# EAGLE design cms_intro_adc (EAGLE 5.10)
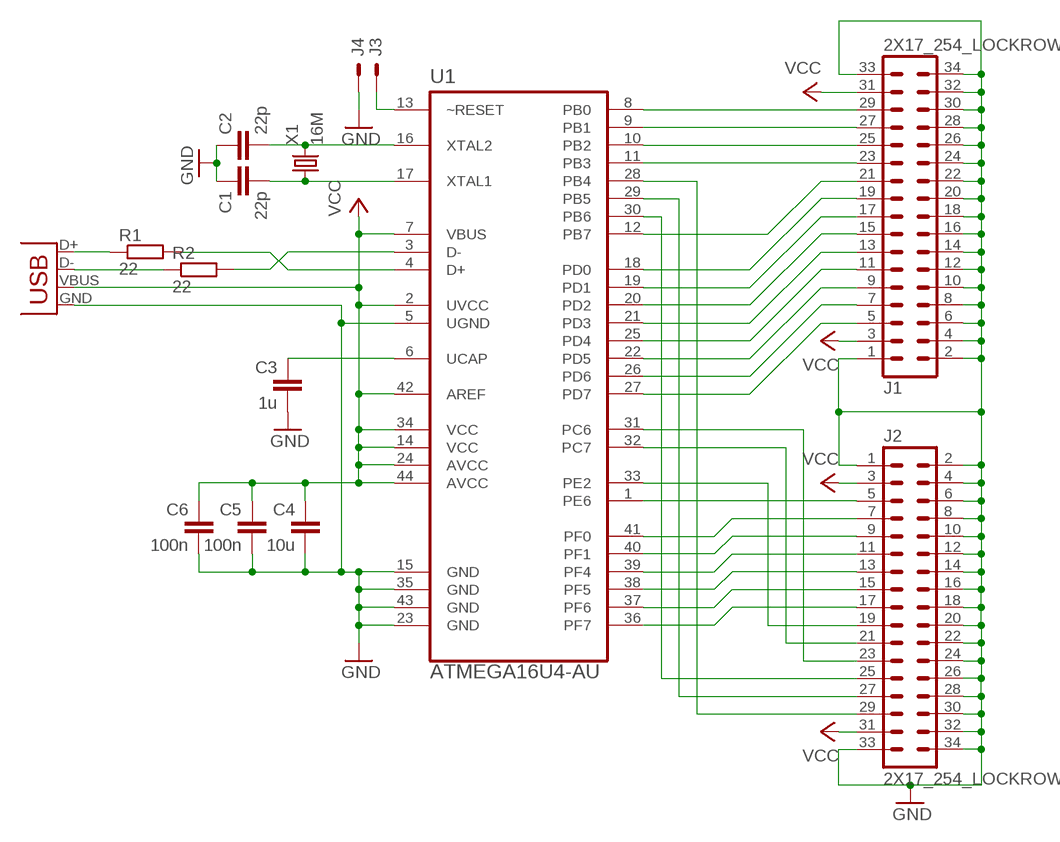
[diagram p0: schematic, sheet 1]

## Parts
C1  22p  C-EUC0603  [C0603]
C2  22p  C-EUC0603  [C0603]
C3  1u  C-EUC0603  [C0603]
C4  10u  C-EUC0603  [C0603]
C5  100n  C-EUC0603  [C0603]
C6  100n  C-EUC0603  [C0603]
J1  2X17_254_LOCKROW  [2X17_254_LOCKROW]
J2  2X17_254_LOCKROW  [2X17_254_LOCKROW]
J3  1X1E_254  [1X1_254]
J4  1X1E_254  [1X1_254]
R1  22  R-EU_R0603  [R0603]
R2  22  R-EU_R0603  [R0603]
U1  ATMEGA16U4-AU  [QFP80P1200X1200X120-44N]
X1  16M  CRYSTALSM49  [SM49]
X7  USB-MICROB-S-LONG  [USB-MICROB-LONG]

## Nets
B0: J1.29 U1.8(PB0)
B1: J1.27 U1.9(PB1)
B2: J1.25 U1.10(PB2)
B3: J1.23 U1.11(PB3)
B4: J2.29 U1.28(PB4)
B5: J2.27 U1.29(PB5)
B6: J2.25 U1.30(PB6)
B7: J1.21 U1.12(PB7)
C6: J2.23 U1.31(PC6)
C7: J2.21 U1.32(PC7)
D0: J1.19 U1.18(PD0)
D1: J1.17 U1.19(PD1)
D2: J1.15 U1.20(PD2)
D3: J1.13 U1.21(PD3)
D4: J1.11 U1.25(PD4)
D5: J1.9 U1.22(PD5)
D6: J1.7 U1.26(PD6)
D7: J1.5 U1.27(PD7)
DM: R2.2 U1.3(D-)
DMC: R2.1 X7.D-
DP: R1.2 U1.4(D+)
DPC: R1.1 X7.D+
E2_HWB: J2.19 U1.33(PE2)
E6: J2.5 U1.1(PE6)
F0: J2.7 U1.41(PF0)
F1: J2.9 U1.40(PF1)
F4: J2.11 U1.39(PF4)
F5: J2.13 U1.38(PF5)
F6: J2.15 U1.37(PF6)
F7: J2.17 U1.36(PF7)
GND [supply]: C1.1 C2.1 C3.2 C4.2 C5.2 C6.2 J1.1 J1.2 J1.4 J1.6 J1.8 J1.10 J1.12 J1.14 J1.16 J1.18 J1.20 J1.22 J1.24 J1.26 J1.28 J1.30 J1.32 J1.33 J1.34 J2.1 J2.2 J2.4 J2.6 J2.8 J2.10 J2.12 J2.14 J2.16 J2.18 J2.20 J2.22 J2.24 J2.26 J2.28 J2.30 J2.32 J2.33 J2.34 J4.1(S) U1.5(UGND) U1.15(GND) U1.23(GND) U1.35(GND) U1.43(GND) X7.GND
RESET: J3.1(S) U1.13(~RESET)
UCAP: C3.1 U1.6(UCAP)
VCC [supply]: C4.1 C5.1 C6.1 J1.3 J1.31 J2.3 J2.31 U1.2(UVCC) U1.7(VBUS) U1.14(VCC) U1.24(AVCC) U1.34(VCC) U1.42(AREF) U1.44(AVCC) X7.VBUS
XTAL1: C1.2 U1.17(XTAL1) X1.1
XTAL2: C2.2 U1.16(XTAL2) X1.2

## Library data of the parts
C1-C6 = rcl:C-EU: CAPACITOR, European symbol
J1 J2 = ni-con-rect:2X17_: 2x17 connector
J3 J4 = ni-con-rect:1X1E_: 1x1 connector
R1 R2 = rcl:R-EU_: RESISTOR, European symbol
U1 = at90usb16u4:ATMEGA16U4-AU: Microcontroller with USB Controller; MPN: ATMEGA16U4-AU; OC_FARNELL: 1748521; OC_NEWARK: 26R5623; PACKAGE: TQFP-44; SUPPLIER: Atmel
X1 = crystal:CRYSTAL: CRYSTAL
X7 = apbteam_con-usb:USB: USB Connectors

## Net classes
1 supply: width 0.254 mm

## Board
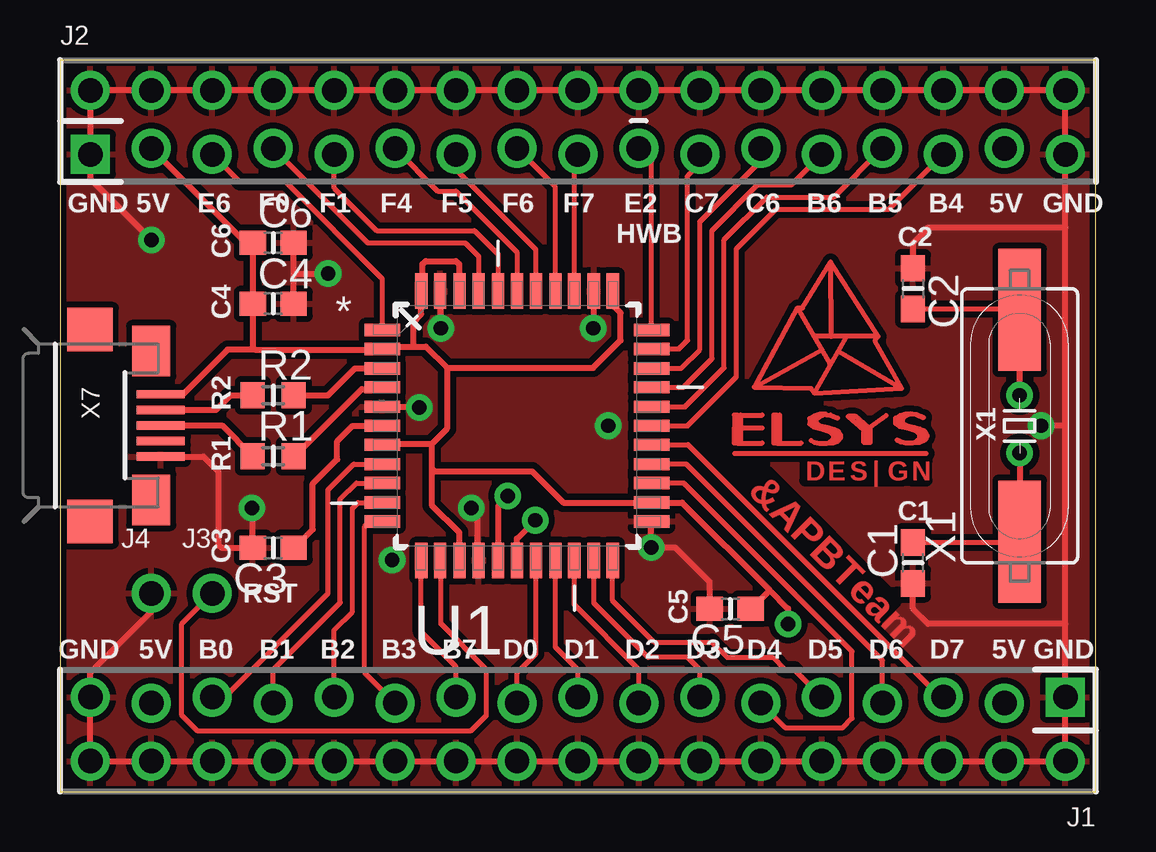
[diagram p1: board, top side]
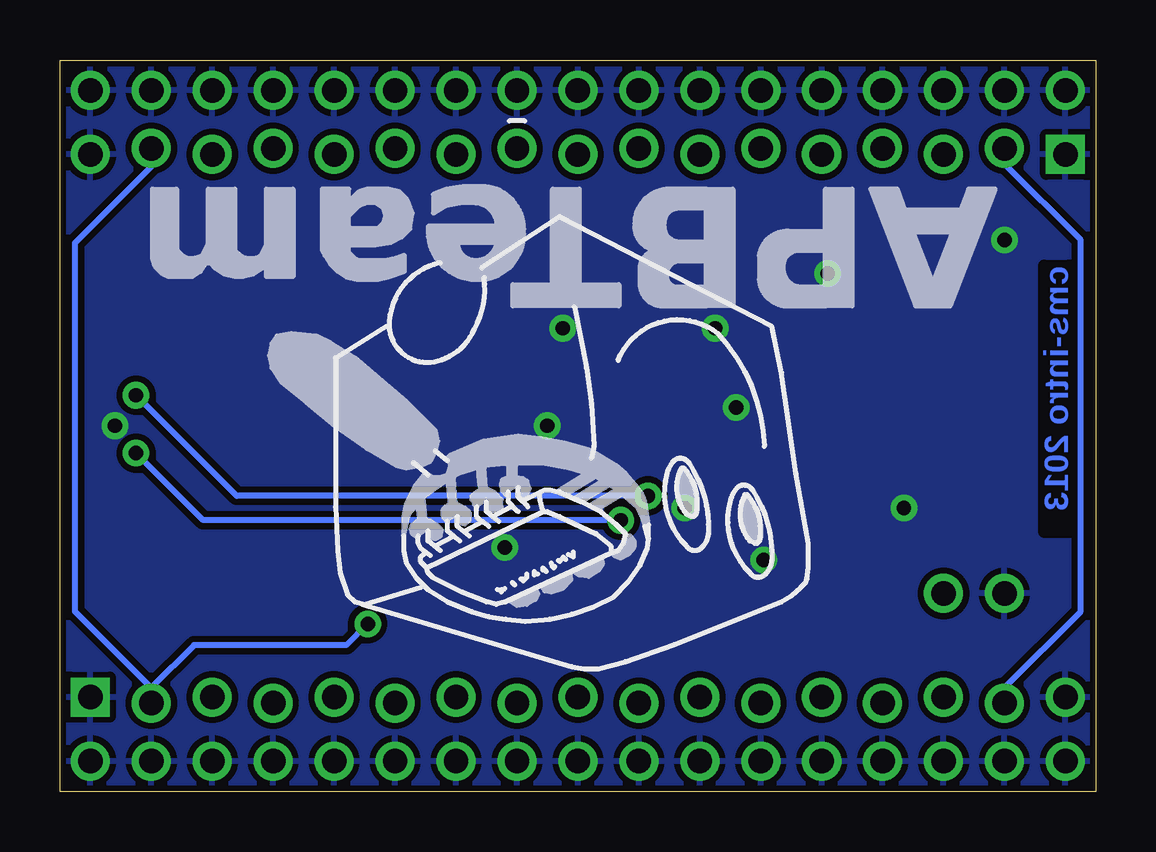
[diagram p2: board, bottom side, seen from below]

Size 43.18 x 30.48 mm. Coordinates in mm from the lower left corner, seen from the top.
Outline: 0,0 43.18,0 43.18,30.48 0,30.48 0,0
Copper layers (1*16): Top 0.035mm / dielectric 1.5mm / Bottom 0.035mm
Design rules "SparkFun *": minimum track width 8mil, minimum drill 20mil, track to track 8mil, track to pad 8mil, pad to pad 8mil, via to via 8mil, smd to smd 8mil, copper to edge 10mil, drill to drill 8mil, minimum pad ring 12mil, minimum via ring 10mil, stop-mask expansion 4mil, vias tented up to drill 25mil, thermal gap 10mil
tRestrict: area -0.1,12.2 to 2.6,18.3

### Footprints (pad centres in the part's own frame; a part is rotated, then mirrored left to right if it is on the bottom)
C0603 = smd 1.1 x 1: 1 -0.85,0; 2 0.85,0
2X17_254_LOCKROW = drill 1.016 square: 1 -20.32,-1.397 | drill 1.016 round: 2 -20.32,1.27; 3 -17.78,-1.143; 4 -17.78,1.27; 5 -15.24,-1.397; 6 -15.24,1.27; 7 -12.7,-1.143; 8 -12.7,1.27; 9 -10.16,-1.397; 10 -10.16,1.27; 11 -7.62,-1.143; 12 -7.62,1.27; 13 -5.08,-1.397; 14 -5.08,1.27; 15 -2.54,-1.143; 16 -2.54,1.27; 17 0,-1.397; 18 0,1.27; 19 2.54,-1.143; 20 2.54,1.27; 21 5.08,-1.397; 22 5.08,1.27; 23 7.62,-1.143; 24 7.62,1.27; 25 10.16,-1.397; 26 10.16,1.27; 27 12.7,-1.143; 28 12.7,1.27; 29 15.24,-1.397; 30 15.24,1.27; 31 17.78,-1.143; 32 17.78,1.27; 33 20.32,-1.397; 34 20.32,1.27
1X1_254 = drill 1.016 round: 1 0,0
R0603 = smd 1 x 1.1: 1 -0.85,0; 2 0.85,0
QFP80P1200X1200X120-44N = smd 1.473 x 0.508: 1 -5.613,3.988; 2 -5.613,3.2; 3 -5.613,2.388; 4 -5.613,1.6; 5 -5.613,0.787; 6 -5.613,0; 7 -5.613,-0.787; 8 -5.613,-1.6; 9 -5.613,-2.388; 10 -5.613,-3.2; 11 -5.613,-3.988; 23 5.613,-3.988; 24 5.613,-3.2; 25 5.613,-2.388; 26 5.613,-1.6; 27 5.613,-0.787; 28 5.613,0; 29 5.613,0.787; 30 5.613,1.6; 31 5.613,2.388; 32 5.613,3.2; 33 5.613,3.988 | smd 0.508 x 1.473: 12 -3.988,-5.613; 13 -3.2,-5.613; 14 -2.388,-5.613; 15 -1.6,-5.613; 16 -0.787,-5.613; 17 0,-5.613; 18 0.787,-5.613; 19 1.6,-5.613; 20 2.388,-5.613; 21 3.2,-5.613; 22 3.988,-5.613; 34 3.988,5.613; 35 3.2,5.613; 36 2.388,5.613; 37 1.6,5.613; 38 0.787,5.613; 39 0,5.613; 40 -0.787,5.613; 41 -1.6,5.613; 42 -2.388,5.613; 43 -3.2,5.613; 44 -3.988,5.613
SM49 = smd 5.08 x 1.778: 1 -4.826,0; 2 4.826,0
USB-MICROB-LONG = smd 0.35 x 2: D+ 0,2.95; D- -0.65,2.95; GND 1.3,2.95; ID 0.65,2.95; VBUS -1.3,2.95 | smd 1.8 x 1.9: MT1 -4,0; MT2 4,0 | smd 2.1 x 1.6: MT3 -3.1,2.55; MT4 3.1,2.55

### Placement (x,y rotation side)
C1  35.56,9.53 90 top
C2  35.56,20.95 270 top
C3  8.89,10.16 180 top
C4  8.89,20.32 0 top
C5  27.94,7.62 180 top
C6  8.89,22.86 0 top
J1  21.59,2.54 180 top
J2  21.59,27.94 0 top
J3  6.35,8.26 0 top
J4  3.81,8.26 0 top
R1  8.89,13.97 0 top
R2  8.89,16.51 0 top
U1  19.05,15.24 0 top
X1  40.01,15.24 90 top
X7  1.25,15.26 270 top

### Tracks (layer width: path | path; a pad name or v marks a point on that pad's centre or on a via)
B0
  Top 0.203: U1.8 12.24,13.64 11.18,12.57 11.18,8.26 6.86,3.94 J1.29
B1
  Top 0.203: U1.9 12.34,12.85 11.68,12.19 11.68,7.87 8.89,5.08 J1.27
B2
  Top 0.203: U1.10 12.42,12.04 12.19,11.81 12.19,7.49 11.43,6.73 J1.25
B3
  Top 0.203: U1.11 12.9,11.25 12.7,11.05 12.7,4.95 J1.23
B4
  Top 0.203: U1.28 26.16,15.24 28.19,17.27 28.19,22.61 29.84,24.26 34.54,24.26 J2.29
B5
  Top 0.203: U1.29 26.06,16.03 27.69,17.65 27.69,22.99 29.46,24.77 32.26,24.77 J2.27
B6
  Top 0.203: U1.30 25.98,16.84 27.18,18.03 27.18,23.37 29.08,25.27 30.48,25.27 J2.25
B7
  Top 0.203: U1.12 15.06,6.66 16.51,5.21 J1.21
C6
  Top 0.203: U1.31 25.88,17.63 26.67,18.41 26.67,23.75 29.21,26.29 J2.23
C7
  Top 0.203: U1.32 25.81,18.44 26.16,18.8 26.16,25.65 26.67,26.16 J2.21
D0
  Top 0.203: U1.18 19.84,5.74 19.05,4.95 J1.19
D1
  Top 0.203: U1.19 20.65,6.02 21.59,5.08 J1.17
D2
  Top 0.203: U1.20 21.44,7.77 24.13,5.08 J1.15
D3
  Top 0.203: U1.21 22.25,7.85 24.51,5.59 26.16,5.59 26.67,5.08 J1.13
D4
  Top 0.203: J1.11 30.23,2.67 32.64,2.67 33.02,3.05 33.02,5.84 26.01,12.85 U1.25
D5
  Top 0.203: U1.22 23.04,7.95 24.77,6.22 27.18,6.22 27.81,5.59 29.72,5.59 30.23,5.08 30.61,5.08 J1.9
D6
  Top 0.203: U1.26 26.11,13.64 34.29,5.46 J1.7
D7
  Top 0.203: U1.27 26.19,14.45 36.7,3.94 J1.5
DM
  Top 0.254: U1.3 12.29,17.63 11.18,16.51 R2.2
DMC
  Top 0.254: X7.D- 6.51,15.9 7.11,16.51 R2.1
DP
  Top 0.254: R1.2 9.78,13.97 12.57,16.76 13.36,16.76 U1.4
DPC
  Top 0.254: X7.D+ 6.75,15.26 R1.1
E2_HWB
  Top 0.203: U1.33 24.66,26.26 J2.19
E6
  Top 0.203: U1.1 13.44,21.36 9.4,25.4 7.49,25.4 J2.5
F0
  Top 0.203: U1.41 17.45,22.3 16.89,22.86 12.83,22.86 J2.7
F1
  Top 0.203: U1.40 18.26,22.38 17.27,23.37 13.21,23.37 11.43,25.15 J2.9
F4
  Top 0.203: U1.39 19.05,22.48 16.51,25.02 15.75,25.02 J2.11
F5
  Top 0.203: U1.38 19.84,22.58 16.51,25.91 J2.13
F6
  Top 0.203: U1.37 20.65,25.2 J2.15
F7
  Top 0.203: U1.36 21.44,26.39 J2.17
GND  (via drill 0.6)
  Top 0.254: U1.43 15.88,20.85 v15.88,19.3 | U1.5 14.99,16.03 v14.99,16 | U1.23 24.64,11.25 v24.64,10.16 25.65,10.16 27.09,8.72 C5.2 | U1.15 17.4,9.63 17.4,11.56 v17.14,11.81 | U1.35 22.25,19.33 v22.23,19.3 | X7.GND 5.98,13.96 6.6,13.34 6.6,10.29 6.73,10.16 C3.2 8.04,11.77 v8,11.81 | 41.91,6.99 J1.1 J1.2 J1.4 J1.6 J1.8 J1.10 J1.12 J1.14 J1.16 J1.18 J1.20 J1.22 J1.24 J1.26 J1.28 J1.30 J1.32 J1.34 J1.33 1.27,4.95 3.81,7.49 J4.1 | 41.91,6.99 41.91,15.24 | 41.91,15.24 41.91,23.5 | 41.91,23.5 J2.33 J2.34 J2.32 J2.30 J2.28 J2.26 J2.24 J2.22 J2.20 J2.18 J2.16 J2.14 J2.12 J2.10 J2.8 J2.6 J2.4 J2.2 J2.1 1.27,25.53 v3.81,22.99 | 41.91,15.24 v40.89,15.24 | C4.2 9.74,21.58 | 9.74,21.58 C6.2 | 9.74,21.58 11.16,21.58 v11.18,21.59 | C1.1 35.56,7.62 36.2,6.99 41.91,6.99 | C2.1 35.56,22.86 36.2,23.5 41.91,23.5
  other vias: 22.86,15.24 13.84,9.65
  pour Top (isolate 0.254): 0,30.48 43.18,30.48 43.18,0 0,0
  pour Bottom (isolate 0.254): 0,30.48 43.18,30.48 43.18,0 0,0
N$5
  Top 0.203: 30.75,20.16 32.09,17.82 | 28.94,16.85 30.75,20.16 | 30.75,20.16 30.95,20.16 32.12,22.06 | 34.1,18.96 32.14,18.96 | 32.14,18.96 31.43,18.96 | 32.12,22.06 34.1,18.96 | 34.1,18.96 33.97,18.78 35.09,16.8 31.46,16.6 | 32.45,18.35 32.78,18.94 | 31.46,16.6 32.45,18.35 | 31.46,16.6 31.3,16.8 28.94,16.85 | 28.94,16.85 31.76,18.4 | 32.12,22.06 32.14,18.96 | 32.45,18.35 35.06,16.8
N$6
  Top 0.203: 28.38,15.68 29.27,15.68 | 28.23,15.68 28.38,15.68 | 28.23,15.68 28.11,15.68 28.11,15.15 | 28.11,15.15 28.11,14.52 28.23,14.52 | 28.38,14.52 29.27,14.52 | 28.11,15.15 29.27,15.15 | 28.38,14.52 28.38,15.68 | 28.23,14.52 28.38,14.52 | 28.23,14.52 28.23,15.68
N$7
  Top 0.203: 29.88,14.52 29.76,14.52 29.76,15.68 29.88,15.68 | 30.01,14.52 30.9,14.52 | 29.88,15.68 30.01,15.68 30.01,14.52 | 29.88,14.52 30.01,14.52 | 29.88,14.52 29.88,15.68
N$13
  Top 0.203: 31.3,14.62 31.46,14.54 31.66,14.49 31.97,14.49 32.22,14.52 32.42,14.59 | 32.42,14.59 32.55,14.74 32.55,14.85 32.45,15 32.27,15.07 32.02,15.15 31.69,15.23 31.53,15.35 31.51,15.4 31.56,15.53 31.69,15.63 31.89,15.71 31.94,15.7 | 31.94,15.7 32.12,15.68 32.42,15.56 | 31.33,15.25 31.25,15.3 31.25,15.53 31.43,15.63 31.69,15.71 31.94,15.71 31.94,15.7 | 31.33,15.25 31.41,15.2 31.74,15.13 32.12,15 32.24,14.87 32.24,14.67 32.04,14.52 | 31.38,15.51 31.41,15.3 31.41,15.25 31.33,15.25 | 32.37,14.9 32.35,14.64 32.42,14.64 32.42,14.59
N$14
  Top 0.203: 33.69,15.15 33.16,15.63 32.85,15.63 33.52,15.07 33.52,14.54 33.77,14.54 33.77,15.07 | 33.77,15.07 33.69,15.15 | 34.43,15.66 33.77,15.18 33.77,15.07 | 33.64,14.62 33.67,15.1 33.67,15.15 33.69,15.15
N$15
  Top 0.203: 28.13,14.08 36.11,14.08
N$16
  Top 0.203: 34.89,14.64 35.04,14.57 35.24,14.52 35.55,14.52 35.8,14.54 36.01,14.62 | 36.01,14.62 36.13,14.77 36.13,14.87 36.03,15.02 35.85,15.1 35.6,15.18 35.27,15.25 35.12,15.38 35.09,15.43 35.14,15.56 35.27,15.66 35.47,15.73 | 35.47,15.73 35.7,15.71 36.01,15.58 | 35.47,15.73 35.52,15.73 | 34.99,15.23 34.84,15.33 34.84,15.56 35.01,15.66 35.27,15.73 35.47,15.73 | 34.99,15.23 35.32,15.15 35.7,15.02 35.83,14.9 35.83,14.69 35.62,14.54 | 34.96,15.53 34.99,15.33 34.99,15.23 | 35.95,14.92 35.93,14.67 35.93,14.62 36.01,14.62
RESET
  Top 0.203: J3.1 5.08,6.99 5.08,3.17 5.71,2.54 17.14,2.54 17.78,3.17 17.78,5.08 15.88,6.99 15.88,9.6 U1.13
UCAP
  Top 0.254: C3.1 9.78,10.16 10.54,10.92 10.54,12.83 11.56,13.84 11.56,14.61 12.19,15.24 U1.6
VCC  (via drill 0.6)
  Top 0.254: U1.42 16.64,20.88 16.64,21.97 16.51,22.1 15.24,22.1 15.11,21.97 15.11,20.9 U1.44 15.06,19.89 14.73,19.56 14.73,18.54 | 14.73,18.54 13.54,18.54 U1.2 13.41,18.41 8.13,18.41 | 14.73,18.54 15.24,18.54 16.13,17.65 | 16.13,17.65 16.13,15.11 15.49,14.48 | 15.49,14.48 13.46,14.48 U1.7 | 15.49,13.46 15.49,11.94 16.64,10.79 16.64,9.65 U1.14 | 15.49,14.48 15.49,13.46 | 15.49,13.46 15.62,13.34 19.68,13.34 20.98,12.04 U1.24 25.93,12.04 29.59,8.38 | 16.13,17.65 22.23,17.65 23.37,18.8 23.37,19.94 23.11,20.19 23.11,20.78 U1.34 | X7.VBUS 5.12,16.55 6.99,18.41 8.13,18.41 | 8.13,18.41 8.04,18.5 C4.1 C6.1 7.75,22.86 J2.3 | 29.59,8.38 30.35,7.62 v30.35,6.99 | C5.1 28.83,7.62 29.59,8.38
  Bottom 0.254: J2.3 3.81,26.16 0.64,22.99 0.64,7.49 3.81,4.32 J1.31 | 39.37,4.32 J1.3 | 39.37,4.32 42.55,7.49 42.55,22.86 39.37,26.04 J2.31 | v30.35,6.99 31.24,6.1 37.59,6.1 39.37,4.32
XTAL1  (via drill 0.6)
  Top 0.203: C1.2 40.01,10.38 X1.1
  Top 0.254: U1.17 19.05,10.54 v19.81,11.3 | v40.01,14.1 X1.1
  Bottom 0.254: v19.81,11.3 37.21,11.3 v40.01,14.1
XTAL2  (via drill 0.6)
  Top 0.203: C2.2 40.01,20.11 X1.2
  Top 0.254: U1.16 18.29,9.65 18.29,11.94 v18.67,12.32 | v40.01,16.51 X1.2
  Bottom 0.254: v18.67,12.32 35.81,12.32 v40.01,16.51

### Text on the board
Top: D | E | S | | | G | N | &APBTeam
Bottom: cms-intro 2013
tSilk: GND | 5V | E6 | F0 | F1 | F4 | F5 | F6 | F7 | E2 | C7 | C6 | B6 | B5 | B4 | 5V | GND | HWB | C2 | C6 | C4 | R2 | X1 | R1 | C1 | C3 | RST | C5 | GND | 5V | B0 | B1 | B2 | B3 | B7 | D0 | D1 | D2 | D3 | D4 | D5 | D6 | D7 | 5V | GND